# EasyEDA Pro project ProProject_Magic_wand_2024-10-27.epro

# Schematic Schematic1
Create Date: 2024-09-07; Page Name: P1; Project Name: Magic_wand; Schematic Name: Schematic1; Update Date: 2024-09-07
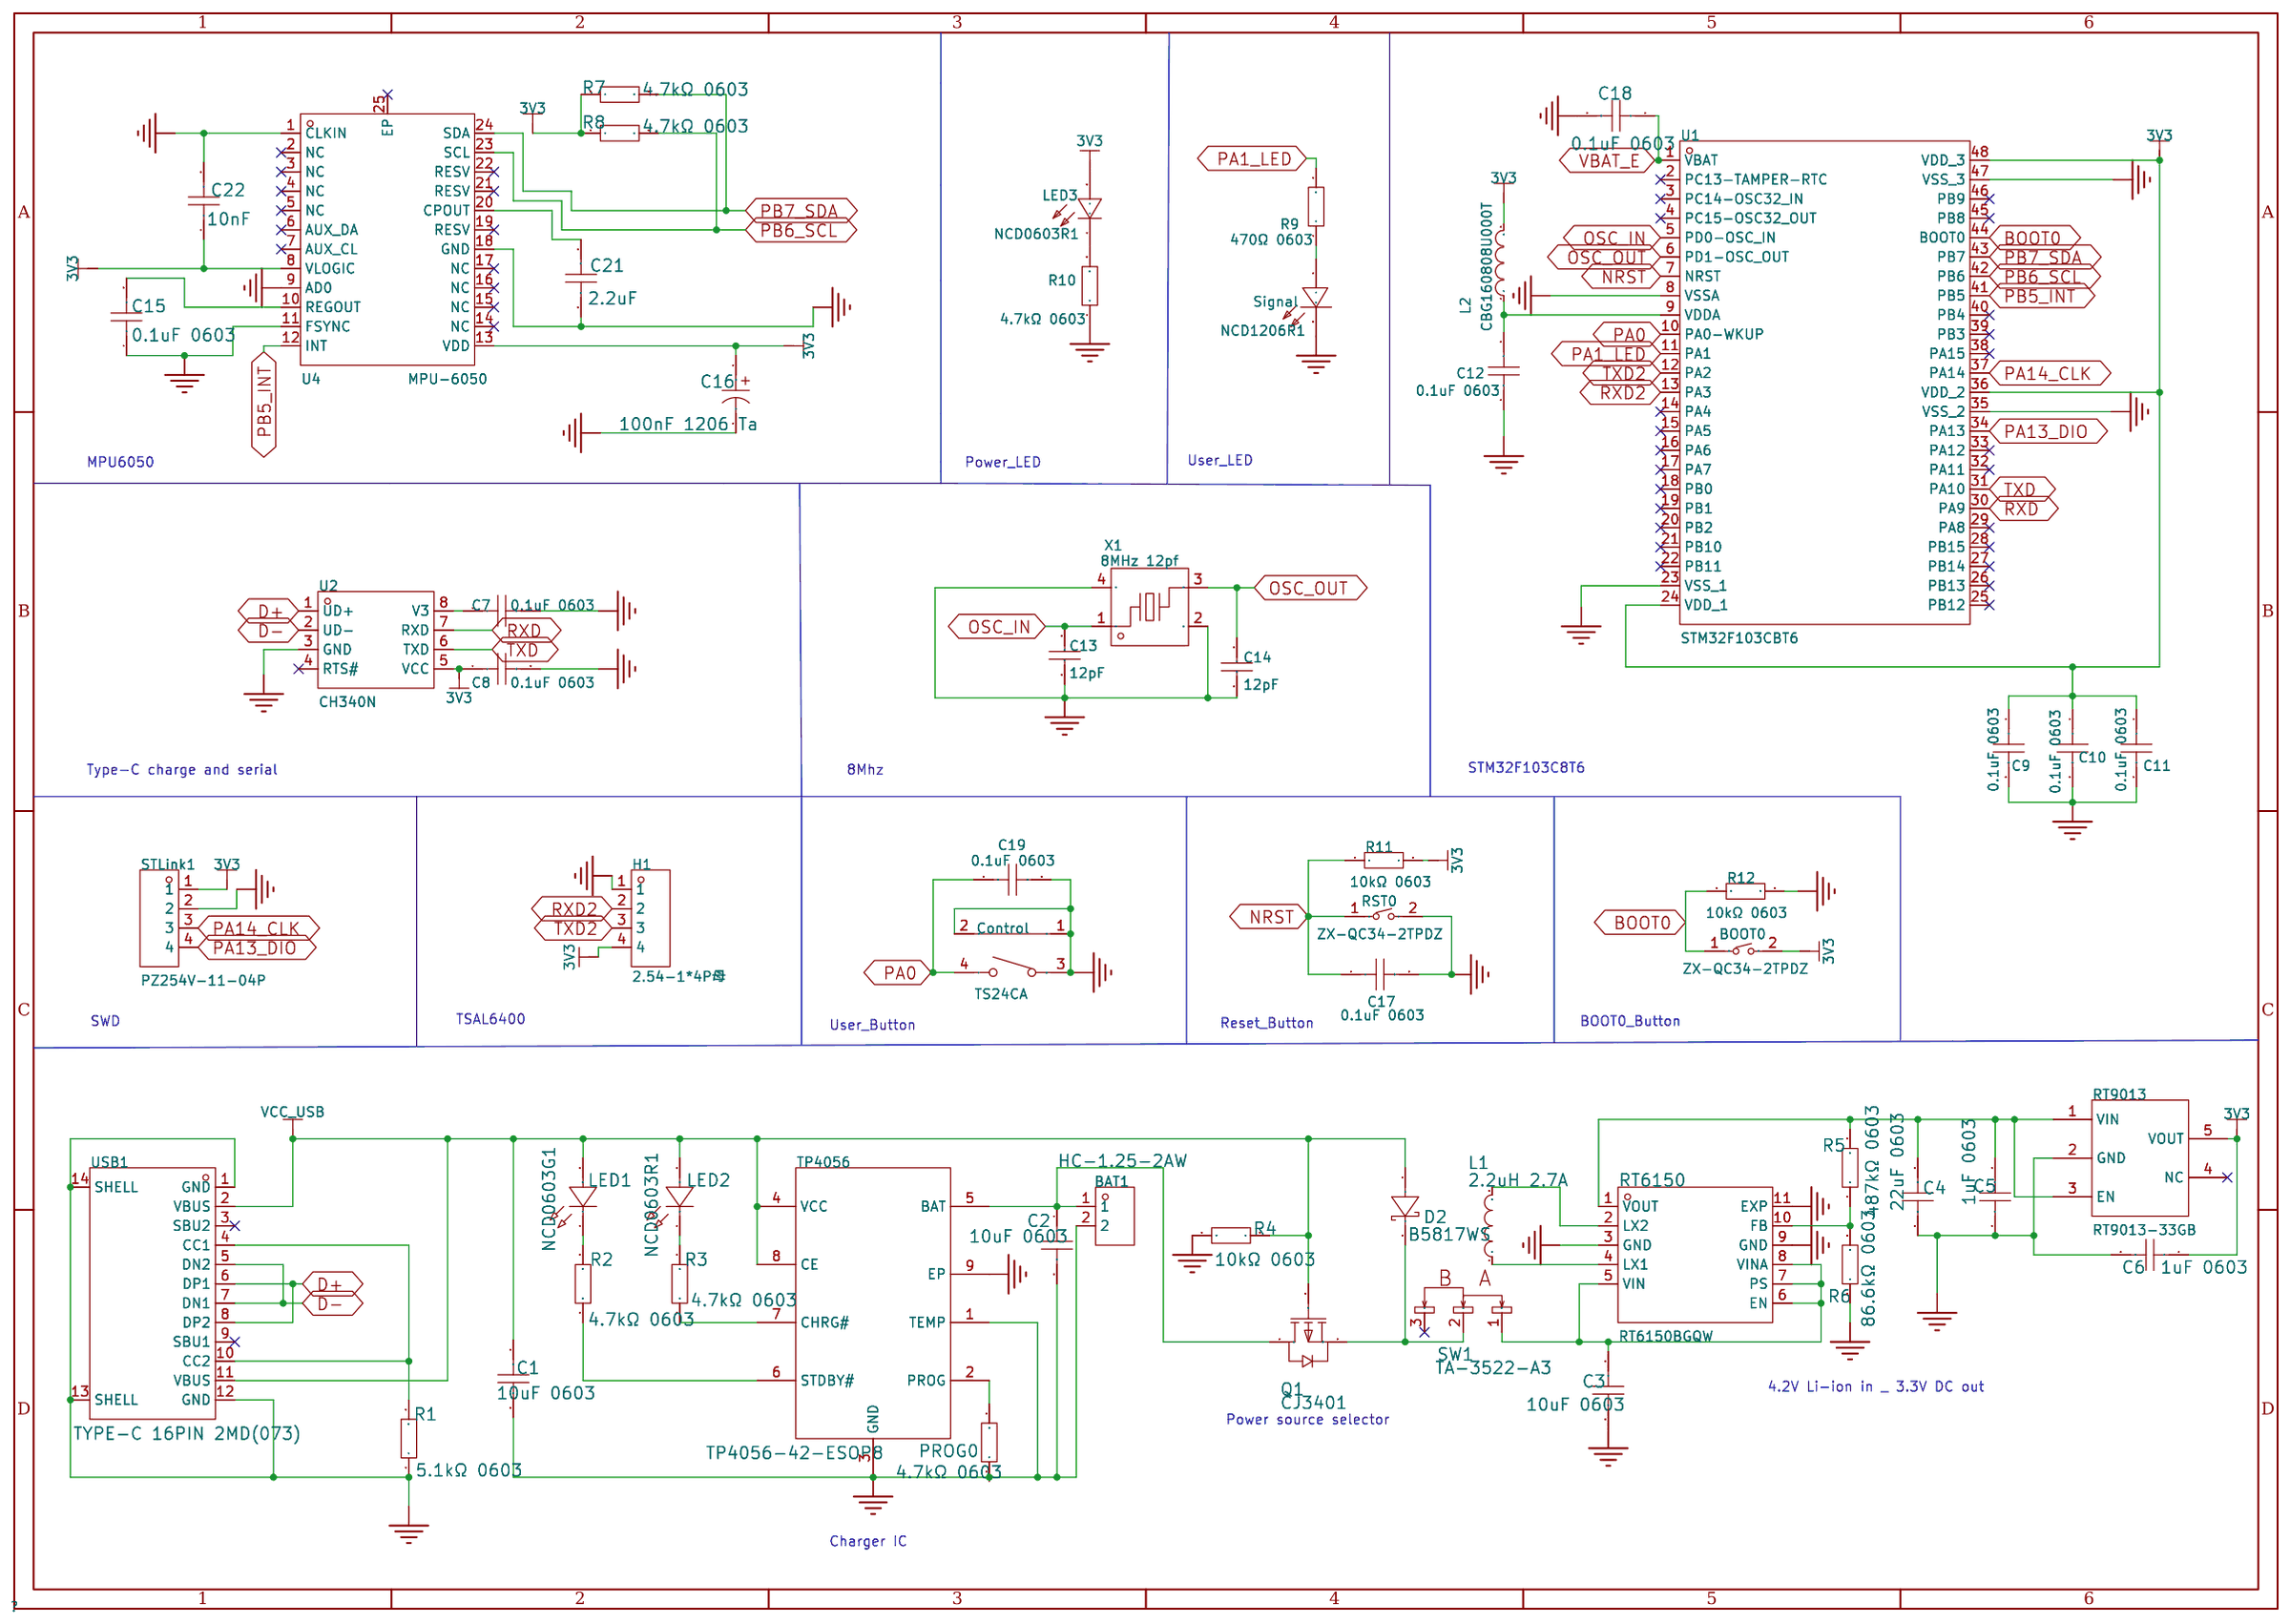
[diagram p0: schematic sheet]

## Parts
BAT1  HC-1.25-2AW  [CONN-TH_2P-P1.25_HCTL_HC-1.25-2AW]
BOOT0  ZX-QC34-2TPDZ  [KEY-SMD_L3.9-W3.0-LS5.0-EH]
C1  10uF 0603  [C0603]
C2  10uF 0603  [C0603]
C3  10uF 0603  [C0603]
C4  22uF 0603  [C0603]
C5  1uF 0603  [C0603]
C6  1uF 0603  [C0603]
C7  0.1uF 0603  [C0603]
C8  0.1uF 0603  [C0603]
C9  0.1uF 0603  [C0603]
C10  0.1uF 0603  [C0603]
C11  0.1uF 0603  [C0603]
C12  0.1uF 0603  [C0603]
C13  12pF  [C0603]
C14  12pF  [C0603]
C15  0.1uF 0603  [C0603]
C16  100nF 1206 Ta  [CAP-SMD_L3.2-W1.6-RD]
C17  0.1uF 0603  [C0603]
C18  0.1uF 0603  [C0603]
C19  0.1uF 0603  [C0603]
C21  2.2uF  [C0603]
C22  10nF  [C0603]
Control  TS24CA  [SW-SMD_TS24CA]
D2  B5817WS  [SOD-323_L1.7-W1.3-LS2.5-FD]
H1  2.54-1*4P母  [HDR-TH_4P-P2.54-V-F]
L1  2.2uH 2.7A  [IND-SMD_L2.5-W2.0]
L2  CBG160808U000T  [L0603]
LED1  NCD0603G1  [LED0603-RD]
LED2  NCD0603R1  [LED0603-RD_RED]
LED3  NCD0603R1  [LED0603-RD_RED]
PROG0  4.7kΩ 0603  [R0603]
Q1  CJ3401  [SOT-23-3_L2.9-W1.6-P1.90-LS2.8-BR]
R1  5.1kΩ 0603  [R0603]
R2  4.7kΩ 0603  [R0603]
R3  4.7kΩ 0603  [R0603]
R4  10kΩ 0603  [R0603]
R5  487kΩ 0603  [R0603]
R6  86.6kΩ 0603  [R0603]
R7  4.7kΩ 0603  [R0603]
R8  4.7kΩ 0603  [R0603]
R9  470Ω 0603  [R0603]
R10  4.7kΩ 0603  [R0603]
R11  10kΩ 0603  [R0603]
R12  10kΩ 0603  [R0603]
RST0  ZX-QC34-2TPDZ  [KEY-SMD_L3.9-W3.0-LS5.0-EH]
RT6150  RT6150BGQW  [WSON-10_L2.5-W2.5-P0.50-BL-EP]
RT9013  RT9013-33GB  [SOT-23-5_L3.0-W1.7-P0.95-LS2.8-BL]
Signal  NCD1206R1  [LED1206-R-RD_RED]
STLink1  PZ254V-11-04P  [HDR-TH_4P-P2.54-V-M]
SW1  TA-3522-A3  [SW-TH_3P-L9.1-W3.5-P2.50-A3]
TP4056  TP4056-42-ESOP8  [ESOP-8_L4.9-W3.9-P1.27-LS6.0-BL-EP]
U1  STM32F103CBT6  [LQFP-48_L7.0-W7.0-P0.50-LS9.0-BL]
U2  CH340N  [SOP-8_L4.9-W3.9-P1.27-LS6.0-BL]
U4  MPU-6050  [QFN-24_L4.0-W4.0-P0.50-BL-EP2.7]
USB1  TYPE-C 16PIN 2MD(073)  [USB-C-SMD_TYPE-C-6PIN-2MD-073]
X1  8MHz 12pf  [OSC-SMD_4P-L3.2-W2.5-BL]

## Library data of the parts
BAT1 = HC-1.25-2AW: 插针结构:1x2P;间距:1.25mm;安装方式:弯插;参考系列:-;总PIN数:2P;排数:1;每排PIN数:2;行距:-;额定电流:1A;触头材质:黄铜;触头镀层:锡;工作温度范围:-25℃~+85℃;; LCSC Part Name: 1x2P 间距:1.25mm 弯插; Supplier Part: C2845535; Manufacturer: HCTL(华灿天禄); Supplier Footprint: 弯插,P=1.25mm; JLCPCB Part Class: 扩展库; Datasheet: https://atta.szlcsc.com/upload/public/pdf/source/20230707/04F6BEA69F699E7BB6558EF06AF1DC24.pdf; Supplier: LCSC; Pins Structure: 1x2P; Pitch: 1.25mm; Mounting Style: 弯插; Number of Pins: 2P; Number of Rows: 1; Number of PINs Per Row: 2; Current Rating (Max): 1A; Contact Material: 黄铜; Contact Plating: 锡; Operating Temperature Range: -25℃~+85℃
BOOT0 RST0 = ZX-QC34-2TPDZ: 电路结构:单刀单掷;按钮形状:圆形按钮;作用力:2.6N;安装方式:立贴;开关长度:3mm;开关宽度:4mm;开关高度:2mm;带支架:不带;触点电流:50mA;额定电压(AC):250V;额定电压(DC):12V;绝缘电阻:100MΩ;机械寿命:10万次;; LCSC Part Name: 3*4*2贴片开关带柱; Supplier Part: C7470219; Manufacturer: Megastar(兆星); Supplier Footprint: SMD; JLCPCB Part Class: 扩展库; Datasheet: https://atta.szlcsc.com/upload/public/pdf/source/20230724/D2731FAADF93973E25928DE23F241F8A.pdf; Supplier: LCSC; Circuit: 单刀单掷; Actuator Style: 圆形按钮; Operating Force: 2.6N; Mounting Style: 立贴; Switch Length: 3mm; Switch Width: 4mm; Switch Height: 2mm; Strike Gundam: 不带; Contact Current: 50mA; Voltage Rating (AC): 250V; Voltage Rating (DC): 12V; Insulation Resistance: 100MΩ; Actuator/Cap Color: 黑色; Pin Style: 鸥翼型; Mechanical Life: 10万次; Operating Temperature: -30℃~+80℃
C1-C12 C15 C17-C19 = CC0603JRNPO9BN101: 容值:100pF;精度:±5%;额定电压:50V;材质(温度系数):NP0;; LCSC Part Name: 100pF ±5% 50V; Supplier Part: C14665; Manufacturer: YAGEO(国巨); Supplier Footprint: 0603; JLCPCB Part Class: 扩展库; Datasheet: https://atta.szlcsc.com/upload/public/pdf/source/20181008/C309499_21CC21451B82C39E3D92150FD6B30293.pdf; Supplier: LCSC; Tolerance: ±5%; Voltage Rated: 50V; Temperature Coefficient: NP0
C13 C14 = CC0603JRNPO9BN200: 容值:20pF;精度:±5%;额定电压:50V;材质(温度系数):NP0;; LCSC Part Name: 20pF ±5% 50V; Supplier Part: C105621; Manufacturer: YAGEO(国巨); Supplier Footprint: 0603; JLCPCB Part Class: 扩展库; Datasheet: https://atta.szlcsc.com/upload/public/pdf/source/20170505/1493957838062.pdf; Supplier: LCSC; Tolerance: ±5%; Voltage Rated: 50V; Temperature Coefficient: NP0
C16 = CA45-A-35V-0.1UF-K: 容值:100nF;精度:±10%;额定电压:35V;; LCSC Part Name: 100nF ±10% 35V; Supplier Part: C2976900; Manufacturer: CEC(振华新云); Supplier Footprint: SMD,1.6x3.2mm; JLCPCB Part Class: 扩展库; Datasheet: https://atta.szlcsc.com/upload/public/pdf/source/20220222/C2C5F368BEBB90E653B4407F98E5644A.pdf; Supplier: LCSC; Tolerance: ±10%; Rated Voltage: 35V; Operating Temperature: -55℃~+125℃
C21 = CL10A225KO8NNNC: 容值:2.2uF;精度:±10%;额定电压:16V;材质(温度系数):X5R;; LCSC Part Name: 2.2uF ±10% 16V; Supplier Part: C23630; Manufacturer: SAMSUNG(三星); Supplier Footprint: 0603; JLCPCB Part Class: Basic Part; Datasheet: https://atta.szlcsc.com/upload/public/pdf/source/20160218/1457707763339.pdf; Supplier: LCSC; Tolerance: ±10%; Voltage Rated: 16V; Temperature Coefficient: X5R
C22 = CC0603KRX7R9BB103: 容值:10nF;精度:±10%;额定电压:50V;材质(温度系数):X7R;; LCSC Part Name: 10nF ±10% 50V; Supplier Part: C100042; Manufacturer: YAGEO(国巨); Supplier Footprint: 0603; JLCPCB Part Class: Extended Part; Datasheet: https://atta.szlcsc.com/upload/public/pdf/source/20181008/C309510_22F155564471FAF6A489F7D68F34234E.pdf; Supplier: LCSC; Tolerance: ±10%; Voltage Rated: 50V; Temperature Coefficient: X7R
Control = TS24CA: 电路结构:单刀单掷;按钮形状:矩形按钮;安装方式:卧贴;开关长度:4.55mm;开关宽度:1.8mm;开关高度:3.5mm;触点电流:50mA;额定电压(DC):12V;带灯:-;机械寿命:-;; LCSC Part Name: 4.55*1.8*3.5mm 卧贴 轻触开关; Supplier Part: C393942; Manufacturer: SHOU HAN(首韩); Supplier Footprint: SMD; JLCPCB Part Class: 扩展库; Datasheet: https://atta.szlcsc.com/upload/public/pdf/source/20190521/C393942_591A9E318887EFA4274D34029981AD99.pdf; Supplier: LCSC; Circuit: 单刀单掷; Actuator Style: 矩形按钮; Mounting Style: 卧贴; Switch Length: 4.55mm; Switch Width: 1.8mm; Switch Height: 3.5mm; Contact Current: 50mA; Voltage Rating (DC): 12V
D2 = B5817WS_C7420329: 二极管配置:独立式;正向压降(Vf):450mV@1.0A;直流反向耐压(Vr):20V;平均整流电流(Io):1A;; LCSC Part Name: 电压:20V 电流:1A; Supplier Part: C7420329; Manufacturer: 宏迦橙; Supplier Footprint: SOD-323; JLCPCB Part Class: 扩展库; Datasheet: https://atta.szlcsc.com/upload/public/pdf/source/20230828/03CA0F4F90DAE368A7153B7B5E4D0651.pdf; Supplier: LCSC; Diode Configuration: 独立式; Forward Voltage (Vf@If): 450mV@1.0A; Reverse Voltage (Vr): 20V; Average Rectified Current (Io): 1A; Reverse Leakage Current (Ir): 1mA@20V
H1 = 2.54-1*4P母: 插孔结构:1x4P;间距:2.54mm;行距:-;圆孔/方孔:方孔;安装类型:直插;排数:单排;总孔位数:4P;额定电流:3A;额定电压:-;插孔方向:顶部;塑高:-;触头材质:青铜;触头镀层:-;工作温度范围:-40℃~+105℃;焊接温度(最大值):-;; LCSC Part Name: 间距:2.54mm 1x4P 直插; Supplier Part: C2718488; Manufacturer: BOOMELE(博穆精密); Supplier Footprint: 插件,P=2.54mm; JLCPCB Part Class: 扩展库; Datasheet: https://atta.szlcsc.com/upload/public/pdf/source/20210301/C2718488_F4427B881E42CAA8DDB0B1C12B3A522C.pdf; Supplier: LCSC; Holes Structure: 1x4P; Pitch: 2.54mm; Circular Hole / Square Hole: 方孔; Mounting Type: 直插; Number of Rows: 单排; Number of Holes: 4P; Current Rating (Max): 3A; Holes Direction: 顶部; Contact Material: 青铜; Operating Temperature Range: -40℃~+105℃
L1 = SRN2512-2R2M: 电感值:2.2uH;精度:±20%;额定电流:2.3A;饱和电流(Isat):2.7A;类型:-;; LCSC Part Name: 2.2uH ±20% 2.7A; Supplier Part: C2041574; Manufacturer: BOURNS; Supplier Footprint: 1008; JLCPCB Part Class: 扩展库; Datasheet: https://atta.szlcsc.com/upload/public/pdf/source/20210630/9277016DFE24E5B118E2E0BE21877B47.pdf; Supplier: LCSC; Tolerance: ±20%; Rated Current: 2.3A; Saturation Current (Isat): 2.7A; DC Resistance (DCR): 102mΩ
L2 = CBG160808U000T: 标称阻抗@测试频率:0Ω@100MHz;直流电阻(RDC):100mΩ;; LCSC Part Name: 单路 0603磁珠 阻抗0Ω@100MHz; Supplier Part: C43163; Manufacturer: FH(风华); Supplier Footprint: 0603; JLCPCB Part Class: 扩展库; Datasheet: https://atta.szlcsc.com/upload/public/pdf/source/20190129/C361667_1614D407CC98D1D3CFBD9E1F7511C14D.pdf; Supplier: LCSC; Impedance @ Frequency: 0Ω@100MHz; DC Resistance: 100mΩ; Current Rating: 800mA; Circuits: 1
LED1 = NCD0603G1: 发光颜色:翠绿色;正向电压(VF):2.6V~3.6V;功率:72mW;正向电流:10mA;主波长:515nm~530nm;透镜颜色:无色透明透镜;发光强度:330mcd~900mcd;发光角度:130°;工作温度:-30℃~+85℃;; Supplier Part: C84267; Manufacturer: 国星光电; Supplier Footprint: 0603; JLCPCB Part Class: Extended Part; Datasheet: https://atta.szlcsc.com/upload/public/pdf/source/20200820/C84267_04BA7703640BAC111D09F5EFB971FBF3.pdf; Supplier: LCSC; Emitted Color: 翠绿色; Forward Voltage (VF): 2.6V~3.6V; Power Dissipation: 72mW; Forward Current: 10mA; Dominant Wavelength: 515nm~530nm; Lens Color: 无色透明透镜; Luminous Intensity: 330mcd~900mcd; Viewing Angle: 130°; Operating Temperature: -30℃~+85℃; Peak Wavelength: 525nm
LED2 = NCD0603R1_C84263: 灯头类型:-;发光颜色:红色;正向电压(VF):1.6V~2.6V;功率:65mW;正向电流:20mA;主波长:615nm~630nm;二极管配置:独立二极管;透镜颜色:无色透明透镜;色温:-;发光强度:80mcd~220mcd;发光角度:130°;载带方式:-;工作温度:-30℃~+85℃;; Supplier Part: C84263; Manufacturer: 国星光电; Supplier Footprint: 0603; JLCPCB Part Class: Extended Part; Datasheet: https://atta.szlcsc.com/upload/public/pdf/source/20200820/C84263_DABC6A75E58F576973B407FDBA283D60.pdf; Supplier: LCSC; Emitted Color: 红色; Forward Voltage (VF): 1.6V~2.6V; Power Dissipation: 65mW; Forward Current: 20mA; Dominant Wavelength: 615nm~630nm; Diode Configuration: 独立二极管; Lens Color: 无色透明透镜; Luminous Intensity: 80mcd~220mcd; Viewing Angle: 130°; Operating Temperature: -30℃~+85℃
LED3 = NCD0603R1_C84263: 灯头类型:-;发光颜色:红色;正向电压(VF):1.6V~2.6V;功率:65mW;正向电流:20mA;主波长:615nm~630nm;二极管配置:独立二极管;透镜颜色:无色透明透镜;色温:-;发光强度:80mcd~220mcd;发光角度:130°;载带方式:-;工作温度:-30℃~+85℃;; Supplier Part: C84263; Manufacturer: 国星光电; Supplier Footprint: 0603; JLCPCB Part Class: 扩展库; Datasheet: https://atta.szlcsc.com/upload/public/pdf/source/20200820/C84263_DABC6A75E58F576973B407FDBA283D60.pdf; Supplier: LCSC; Emitted Color: 红色; Forward Voltage (VF): 1.6V~2.6V; Power Dissipation: 65mW; Forward Current: 20mA; Dominant Wavelength: 615nm~630nm; Diode Configuration: 独立二极管; Lens Color: 无色透明透镜; Luminous Intensity: 80mcd~220mcd; Viewing Angle: 130°; Operating Temperature: -30℃~+85℃
PROG0 R1-R12 = 0603WAF1002T5E: 电阻类型:厚膜电阻;阻值:10kΩ;精度:±1%;功率:100mW;最大工作电压:75V;温度系数:±100ppm/℃;; LCSC Part Name: 厚膜电阻 10kΩ ±1% 100mW; Supplier Part: C25804; Manufacturer: UNI-ROYAL(厚声); Supplier Footprint: 0603; JLCPCB Part Class: 基础库; Datasheet: https://atta.szlcsc.com/upload/public/pdf/source/20200306/C422600_1E6D84923E4A46A82E41ADD87F860B5C.pdf; Supplier: LCSC; Type: 厚膜电阻; Tolerance: ±1%; Power(Watts): 100mW; Overload Voltage (Max): 75V; Temperature Coefficient: ±100ppm/℃; Operating Temperature Range: -55℃~+155℃
Q1 = CJ3401: 类型:1个P沟道;漏源电压(Vdss):30V;连续漏极电流(Id):4.2A;功率(Pd):350mW;导通电阻(RDS(on)@Vgs,Id):65mΩ@10V,4.2A;阈值电压(Vgs(th)@Id):1.3V@250uA;; LCSC Part Name: 1个P沟道 耐压:30V 电流:4.2A; Supplier Part: C13799; Manufacturer: CJ(江苏长电/长晶); Supplier Footprint: SOT-23; JLCPCB Part Class: 扩展库; Datasheet: https://atta.szlcsc.com/upload/public/pdf/source/20140815/1457707217656.pdf; Supplier: LCSC; Type: 1个P沟道; Drain Source Voltage (Vdss): 30V; Continuous Drain Current (Id): 4.2A; Power Dissipation (Pd): 350mW; Drain Source On Resistance (RDS(on)@Vgs,Id): 65mΩ@10V,4.2A; Gate Threshold Voltage (Vgs(th)@Id): 1.3V@250uA
RT6150 = RT6150BGQW: 功能类型:升降压型;输入电压:1.8V~5.5V;输出电压:1.8V~5.5V;输出电流(最大值):800mA;; Supplier Part: C147972; Manufacturer: RICHTEK(立锜); Supplier Footprint: WSON-10-EP(2.5x2.5); JLCPCB Part Class: 扩展库; Datasheet: https://atta.szlcsc.com/upload/public/pdf/source/20180126/C147972_15169561259341309260.pdf; Supplier: LCSC; Function: 升降压型; Input Voltage: 1.8V~5.5V; Output Voltage: 1.8V~5.5V; Output Current (Max): 800mA; Switching Frequency: 1MHz; Synchronous Rectification: 是; Number of Outputs: 1; Topology: 降压-升压式; Switch tube (built-in/external): 内置
RT9013 = RT9013-33GB: 输出类型:固定;最大输入电压:5.5V;输出电压:3.3V;最大输出电流:500mA;电源纹波抑制比(PSRR):50dB@(10kHz);输出极性:正极;; LCSC Part Name: 输入5.5V 输出3.3V 500mA; Supplier Part: C47773; Manufacturer: RICHTEK(立锜); Supplier Footprint: SOT-23-5; JLCPCB Part Class: 扩展库; Datasheet: https://atta.szlcsc.com/upload/public/pdf/source/20150504/1457707282459.pdf; Supplier: LCSC; Output Type: 固定; Maximum Input Voltage: 5.5V; Output Voltage: 3.3V; MAX Output Current: 500mA; Power Supply Rejection Ratio (PSRR): 50dB@(10kHz); Dropout Voltage: 400mV@(500mA); standby current: 50uA; Operating Temperature: -40℃~+85℃; Output Polarity: 正极; Number of Outputs: 1
Signal = NCD1206R1: 发光颜色:红色;正向电压(VF):1.6V~2.6V;功率:65mW;正向电流:20mA;主波长:615nm~630nm;透镜颜色:无色透明透镜;发光强度:67mcd~195mcd;发光角度:130°;工作温度:-30℃~+85℃;; Supplier Part: C84270; Manufacturer: 国星光电; Supplier Footprint: 1206; JLCPCB Part Class: 扩展库; Datasheet: https://atta.szlcsc.com/upload/public/pdf/source/20200820/C84270_26D056BA53480CD9796A84C2EB45318C.pdf; Supplier: LCSC; Emitted Color: 红色; Forward Voltage (VF): 1.6V~2.6V; Power Dissipation: 65mW; Forward Current: 20mA; Dominant Wavelength: 615nm~630nm; Lens Color: 无色透明透镜; Luminous Intensity: 67mcd~195mcd; Viewing Angle: 130°; Operating Temperature: -30℃~+85℃
STLink1 = PZ254V-11-04P: 插针结构:1x4P;间距:2.54mm;行距:-;圆针/方针:方针;安装类型:直插;排数:单排;总PIN位数:4P;额定电流:3A;额定电压:250V;配合针长度:6mm;塑高:2.5mm;端接针长度:3mm;触头材质:-;工作温度范围:-40℃~+105℃;颜色:黑色;; LCSC Part Name: 间距:2.54mm 1x4P 直插 方针; Supplier Part: C2691448; Manufacturer: XFCN(兴飞); Supplier Footprint: 插件,P=2.54mm; JLCPCB Part Class: 扩展库; Datasheet: https://atta.szlcsc.com/upload/public/pdf/source/20200309/C492403_F9F19131791D08044AD4F84F8E751A34.pdf; Supplier: LCSC; Pin Structure: 1x4P; Pitch: 2.54mm; Circluar Pins/Square Pins: 方针; Mounting Type: 直插; Number of Rows: 单排; Number of Pins: 4P; Current Rating (Max): 3A; Voltage Rating (Max): 250V; Length of Mating Pin: 6mm; Insulation Height: 2.5mm; Length of End Connection Pin: 3mm; Operating Temperature Range: -40℃~+105℃; Color: 黑色
SW1 = TA-3522-A3: LCSC Part Name: 滑动开关9.1*3.5*4.0mm插件侧拨三脚二档; Supplier Part: C514011; Manufacturer: Yuandi(元迪); Supplier Footprint: 插件-3P,3.5x9.1mm,弯插; JLCPCB Part Class: 扩展库; Datasheet: https://atta.szlcsc.com/upload/public/pdf/source/20200415/C514009_6EED03F5D6F9885D6506BA57997A5078.pdf; Supplier: LCSC
TP4056 = TP4056-42-ESOP8: 锂电池充电芯片 42代表电池满电电压4.2V。; Supplier Part: C16581; Manufacturer: TOPPOWER(南京拓微); Supplier Footprint: ESOP-8; JLCPCB Part Class: 扩展库; Datasheet: https://atta.szlcsc.com/upload/public/pdf/source/20190626/C16581_611BCF5D7CF554EAE465137A8F68DB3E.pdf; Supplier: LCSC
U1 = STM32F103CBT6: CPU内核:ARM-M3;程序存储容量:128KB;RAM总容量:20KB;GPIO端口数量:37;工作电压范围:2V~3.6V;CPU最大主频:72MHz;程序存储器类型:FLASH;; LCSC Part Name: 主流增强型ARM Cortex-M3 MCU，具有128 KB Flash、72 MHz CPU、电机控制、USB和CAN; Supplier Part: C8304; Manufacturer: ST(意法半导体); Supplier Footprint: LQFP-48(7x7); JLCPCB Part Class: Extended Part; Datasheet: https://atta.szlcsc.com/upload/public/pdf/source/20150811/1457707344439.pdf; Supplier: LCSC; CPU Core: ARM-M3; Program Storage Size: 128KB; RAM Size: 20KB; GPIO Ports Number: 37; Operating Voltage Range: 2V~3.6V; CPU Maximum Speed: 72MHz; Program Memory Type: FLASH; Operating Temperature Range: -40℃~+85℃; ADC (Bit): 12bit; Universal Serial Bus: 有; Peripheral/Function: DMA；温度传感器；PWM; Watchdog: 有; Infrared Data Association: 有; Low-Voltage Detect: 有; Direct Memory Access: 有; Internal Oscillator: 有; 16Bit Timer: 3; CAN: 1; UART/USART: 3; I2C: 2; SPI: 3
U2 = CH340N: LCSC Part Name: USB转串口芯片 CH340; Supplier Part: C2977777; Manufacturer: WCH(南京沁恒); Supplier Footprint: SOP-8; JLCPCB Part Class: 扩展库; Datasheet: https://atta.szlcsc.com/upload/public/pdf/source/20230530/6E401E9554E9F5311886CC8B3F89B62E.pdf; Supplier: LCSC
U4 = MPU-6050: 传感器类型:加速度计陀螺仪;; Supplier Part: C24112; Manufacturer: TDK InvenSense(应美盛); Supplier Footprint: QFN-24-EP(4x4); JLCPCB Part Class: 扩展库; Datasheet: https://atta.szlcsc.com/upload/public/pdf/source/20140425/1457707046159.pdf; Supplier: LCSC; Sensor Type: 加速度计陀螺仪; Operating Temperature: -40℃~+85℃
USB1 = TYPE-C 16PIN 2MD(073): 连接器类型:Type-C;标准:-;公母:母;端口数量:1;触点数量:16P;安装方式:卧贴;额定电流 - 电源:5A;工作温度范围:-25℃~+85℃;; LCSC Part Name: Type-C 母 卧贴; Supplier Part: C2765186; Manufacturer: SHOU HAN(首韩); Supplier Footprint: SMD; JLCPCB Part Class: Extended Part; Datasheet: https://atta.szlcsc.com/upload/public/pdf/source/20211123/39B17C16241EAC15C5E277BDA434118E.pdf; Supplier: LCSC; Connector Type: Type-C; Gender: 母; Number of Ports: 1; Number of Contacts: 16P; Mounting Style: 卧贴; Current Rating - Power (Max): 5A; Operating Temperature Range: -25℃~+85℃
X1 = X32258MOB4SI: 晶振类型:贴片晶振;频率:8MHz;常温频差:±10ppm;外接负载电容:12pF;频率稳定度(全温):±20ppm;; LCSC Part Name: 8MHz ±10ppm 12pF; Supplier Part: C2682775; Manufacturer: YXC(扬兴晶振); Supplier Footprint: SMD3225-4P; JLCPCB Part Class: 扩展库; Datasheet: https://atta.szlcsc.com/upload/public/pdf/source/20240329/19D5F850207469550BEB00D7DFEDBC7A.pdf; Supplier: LCSC; Crystal Type: 贴片晶振; Normal temperature Frequency Tolerance: ±10ppm; External load capacitor: 12pF; Frequency Stability(Full temperature range): ±20ppm; Equivalent Series Resistance (ESR): 150Ω; Operating Temperature: -40℃~+85℃

## Nets
3V3: BOOT0.2 C6.1 C8.1 C9.1 C10.1 C11.1 C16.1 C22.1 H1.4 L2.2 LED3.2(A) R7.1 R8.1 R11.2 RT9013.5(VOUT) STLink1.1 U1.24(VDD_1) U1.36(VDD_2) U1.48(VDD_3) U2.5(VCC) U4.8(VLOGIC) U4.13(VDD)
GND: BAT1.2 C1.2 C2.2 C3.2 C4.2 C5.2 C6.2 C7.2 C8.2 C9.2 C10.2 C11.2 C12.1 C13.1 C14.1 C15.1 C16.2 C17.2 C18.2 C19.2 C21.2 C22.2 Control.1 Control.2 Control.3 H1.1 PROG0.1 R1.1 R4.2 R6.1 R10.1 R12.2 RST0.2 RT6150.3(GND) RT6150.9(GND) RT6150.11(EXP) RT9013.2(GND) Signal.2(K) STLink1.2 TP4056.1(TEMP) TP4056.3(GND) TP4056.9(EP) U1.8(VSSA) U1.23(VSS_1) U1.35(VSS_2) U1.47(VSS_3) U2.3(GND) U4.1(CLKIN) U4.9(AD0) U4.11(FSYNC) U4.18(GND) USB1.1(GND) USB1.12(GND) USB1.13(SHELL) USB1.14(SHELL) X1.2(GND) X1.4(GND)
VBAT_E: C18.1 U1.1(VBAT)
VCC_USB: C1.1 D2.1(A) LED1.2(A) LED2.2(A) Q1.1(G) R4.1 TP4056.4(VCC) TP4056.8(CE) USB1.2(VBUS) USB1.11(VBUS)
BOOT0: BOOT0.1 R12.1 U1.44(BOOT0)
D+: U2.1(UD+) USB1.6(DP1) USB1.8(DP2)
D-: U2.2(UD-) USB1.5(DN2) USB1.7(DN1)
NRST: C17.1 R11.1 RST0.1 U1.7(NRST)
OSC_IN: C13.2 U1.5(PD0-OSC_IN) X1.1
OSC_OUT: C14.2 U1.6(PD1-OSC_OUT) X1.3
PA0: C19.1 Control.4 U1.10(PA0-WKUP)
PA1_LED: R9.2 U1.11(PA1)
PA13_DIO: STLink1.4 U1.34(PA13)
PA14_CLK: STLink1.3 U1.37(PA14)
PB5_INT: U1.41(PB5) U4.12(INT)
PB6_SCL: R8.2 U1.42(PB6) U4.23(SCL)
PB7_SDA: R7.2 U1.43(PB7) U4.24(SDA)
RXD: U1.30(PA9) U2.7(RXD)
RXD2: H1.2 U1.13(PA3)
TXD: U1.31(PA10) U2.6(TXD)
TXD2: H1.3 U1.12(PA2)
$1N2583: C12.2 L2.1 U1.9(VDDA)
$1N4826: R9.1 Signal.1(A)
$1N5009: LED3.1(K) R10.2
$1N5948: C7.1 U2.8(V3)
$1N6568: C15.2 U4.10(REGOUT)
$1N6572: C21.1 U4.20(CPOUT)
$1N8092: L1.2 RT6150.2(LX2)
$1N8095: R5.1 R6.2 RT6150.10(FB)
$1N8102: R1.2 USB1.4(CC1) USB1.10(CC2)
$1N8103: LED2.1(K) R3.2
$1N8104: LED1.1(K) R2.2
$1N8106: R3.1 TP4056.7(CHRG#)
$1N8107: R2.1 TP4056.6(STDBY#)
$1N8108: PROG0.2 TP4056.2(PROG)
$1N8109: BAT1.1 C2.1 Q1.3(D) TP4056.5(BAT)
$1N8111: L1.1 RT6150.4(LX1)
$1N8114: D2.2(K) Q1.2(S) SW1.2
$1N8115: C3.1 RT6150.5(VIN) RT6150.6(EN) RT6150.7(PS) RT6150.8(VINA) SW1.1
$1N8116: C4.1 C5.1 R5.2 RT6150.1(VOUT) RT9013.1(VIN) RT9013.3(EN)

Not connected (* = marked no-connect by the designer): RT9013 4(NC)*; SW1 3*; U1 2(PC13-TAMPER-RTC)* 3(PC14-OSC32_IN)* 4(PC15-OSC32_OUT)* 14(PA4)* 15(PA5)* 16(PA6)* 17(PA7)* 18(PB0)* 19(PB1)* 20(PB2)* 21(PB10)* 22(PB11)* 25(PB12)* 26(PB13)* 27(PB14)* 28(PB15)* 29(PA8)* 32(PA11)* 33(PA12)* 38(PA15)* 39(PB3)* 40(PB4)* 45(PB8)* 46(PB9)*; U2 4(RTS#)*; U4 2(NC)* 3(NC)* 4(NC)* 5(NC)* 6(AUX_DA)* 7(AUX_CL)* 14(NC)* 15(NC)* 16(NC)* 17(NC)* 19(RESV)* 21(RESV)* 22(RESV)* 25(EP)*; USB1 3(SBU2)* 9(SBU1)*

## Notes on the sheet
- MPU6050
- Power_LED
- User_LED
- Type-C charge and serial
- 8Mhz
- STM32F103C8T6
- SWD
- TSAL6400
- BOOT0_Button
- User_Button
- Reset_Button
- 4.2V Li-ion in _ 3.3V DC out
- Power source selector
- Charger IC

# Board PCB1
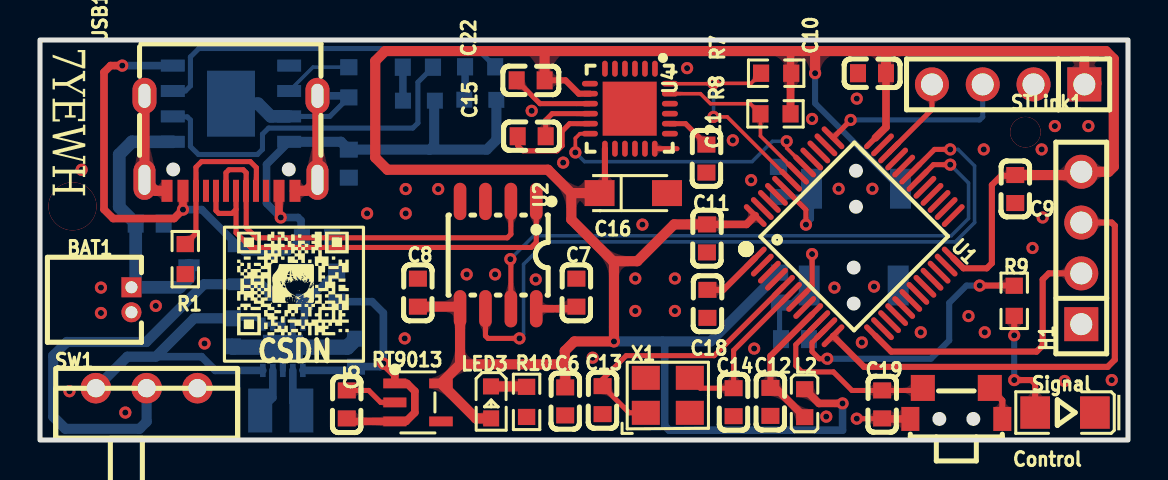
[diagram p1: board, top side]
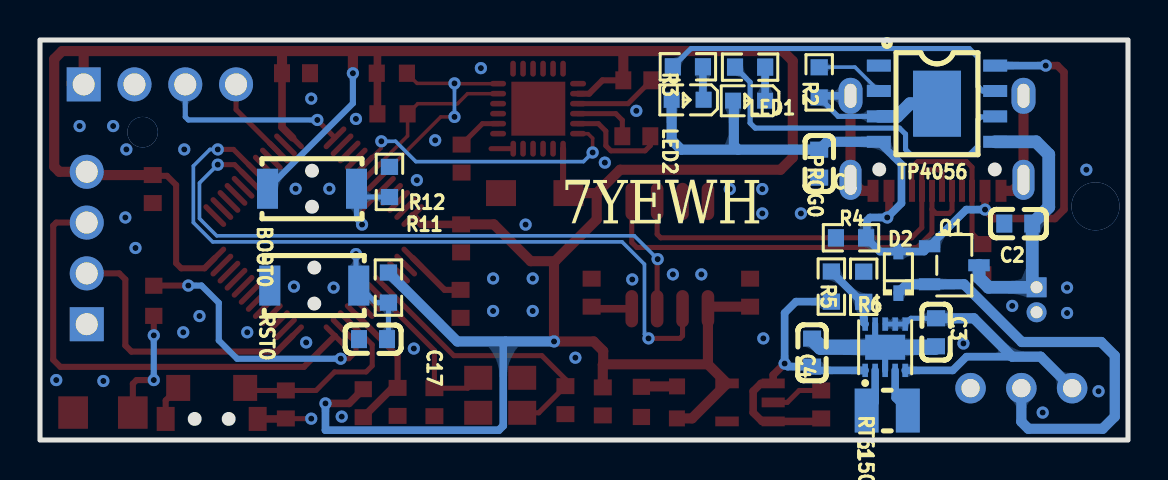
[diagram p2: board, bottom side, seen from below]

Outline 54.41 x 20 mm; copper layers: Top Layer, Bottom Layer. Coordinates in mm from the lower left corner of the outline.
Outline path: rectangle 0,20 54.41,0
Stack: Top Layer 0.035mm / Dielectric1 1.51mm FR4 er 4.5 / Bottom Layer 0.035mm

## Design rules (mm)
template: 自定义配置
spacing copperThickness1oz (default): track to track 0.102, other pairs 0.152 to 0.3
spacing copperThickness2oz: track to track 0.203, other pairs 0.152 to 0.3
track width copperThickness1oz (default): min 0.127, default 0.254, max 2.54
track width copperThickness2oz: min 0.203, default 0.254, max 2.54
differential pair differentialPair (default): width min 0.127, default 0.254, max 2.54; gap min 0.152, default 0.152
via viaSize (default): diameter min 0.5, default 0.61, max 10; hole min 0.3, default 0.305, max 6.299

## Placement (name value [footprint] x y rotation side)
BAT1  HC-1.25-2AW  [CONN-TH_2P-P1.25_HCTL_HC-1.25-2AW]  4.57 7.01 270 top
BOOT0  ZX-QC34-2TPDZ  [KEY-SMD_L3.9-W3.0-LS5.0-EH]  40.81 12.56 0 bottom
C1  10uF 0603  [C0603]  15.44 13.82 270 bottom
C2  10uF 0603  [C0603]  5.49 10.82 0 bottom
C3  10uF 0603  [C0603]  9.6 5.39 270 bottom
C4  22uF 0603  [C0603]  15.8 4.37 90 bottom
C5  1uF 0603  [C0603]  15.34 1.78 90 top
C6  1uF 0603  [C0603]  26.26 1.93 270 top
C7  0.1uF 0603  [C0603]  26.82 7.37 90 top
C8  0.1uF 0603  [C0603]  18.9 7.37 90 top
C9  0.1uF 0603  [C0603]  48.77 12.55 270 top
C10  0.1uF 0603  [C0603]  41.6 18.34 180 top
C11  0.1uF 0603  [C0603]  33.35 10.08 270 top
C12  0.1uF 0603  [C0603]  36.53 1.91 90 top
C13  12pF  [C0603]  28.13 1.99 90 top
C14  12pF  [C0603]  34.69 1.89 90 top
C15  0.1uF 0603  [C0603]  24.59 15.19 0 top
C16  100nF 1206 Ta  [CAP-SMD_L3.2-W1.6-RD]  29.67 12.34 0 top
C17  0.1uF 0603  [C0603]  37.75 5.04 0 bottom
C18  0.1uF 0603  [C0603]  33.38 6.81 270 top
C19  0.1uF 0603  [C0603]  42.11 1.78 270 top
C21  2.2uF  [C0603]  33.32 14.07 270 top
C22  10nF  [C0603]  24.54 17.98 180 top
Control  TS24CA  [SW-SMD_TS24CA]  45.82 1.83 180 top
D2  B5817WS  [SOD-323_L1.7-W1.3-LS2.5-FD]  11.48 8.38 270 bottom
H1  2.54-1*4P母  [HDR-TH_4P-P2.54-V-F]  52.07 9.6 90 top
L1  2.2uH 2.7A  [IND-SMD_L2.5-W2.0]  12.04 1.47 180 bottom
L2  CBG160808U000T  [L0603]  38.24 1.84 90 top
LED1  NCD0603G1  [LED0603-RD]  18.95 16.97 0 bottom
LED2  NCD0603R1  [LED0603-RD_RED]  22.02 17.01 0 bottom
LED3  NCD0603R1  [LED0603-RD_RED]  22.56 1.88 270 top
PROG0  4.7kΩ 0603  [R0603]  15.44 17.88 90 bottom
Q1  CJ3401  [SOT-23-3_L2.9-W1.6-P1.90-LS2.8-BR]  8.69 8.74 0 bottom
R1  5.1kΩ 0603  [R0603]  7.26 9.04 90 top
R2  4.7kΩ 0603  [R0603]  18.9 18.64 180 bottom
R3  4.7kΩ 0603  [R0603]  22.01 18.66 180 bottom
R4  10kΩ 0603  [R0603]  13.85 10.11 0 bottom
R5  487kΩ 0603  [R0603]  14.83 7.67 270 bottom
R6  86.6kΩ 0603  [R0603]  13.22 7.66 270 bottom
R7  4.7kΩ 0603  [R0603]  36.81 18.34 180 top
R8  4.7kΩ 0603  [R0603]  36.78 16.31 180 top
R9  470Ω 0603  [R0603]  48.72 6.96 90 top
R10  4.7kΩ 0603  [R0603]  24.33 1.91 90 top
R11  10kΩ 0603  [R0603]  36.98 7.62 90 bottom
R12  10kΩ 0603  [R0603]  36.93 12.9 90 bottom
RST0  ZX-QC34-2TPDZ  [KEY-SMD_L3.9-W3.0-LS5.0-EH]  40.69 7.72 0 bottom
RT6150  RT6150BGQW  [WSON-10_L2.5-W2.5-P0.50-BL-EP]  12.14 4.64 180 bottom
RT9013  RT9013-33GB  [SOT-23-5_L3.0-W1.7-P0.95-LS2.8-BL]  18.9 1.88 270 top
Signal  NCD1206R1  [LED1206-R-RD_RED]  51.26 1.37 180 top
STLink1  PZ254V-11-04P  [HDR-TH_4P-P2.54-V-M]  48.41 17.78 180 top
SW1  TA-3522-A3  [SW-TH_3P-L9.1-W3.5-P2.50-A3]  5.33 2.59 0 top
TP4056  TP4056-42-ESOP8  [ESOP-8_L4.9-W3.9-P1.27-LS6.0-BL-EP]  9.55 16.81 270 bottom
U1  STM32F103CBT6  [LQFP-48_L7.0-W7.0-P0.50-LS9.0-BL]  40.72 10.16 315 top
U2  CH340N  [SOP-8_L4.9-W3.9-P1.27-LS6.0-BL]  22.91 9.25 180 top
U4  MPU-6050  [QFN-24_L4.0-W4.0-P0.50-BL-EP2.7]  29.5 16.57 180 top
USB1  TYPE-C 16PIN 2MD(073)  [USB-C-SMD_TYPE-C-6PIN-2MD-073]  9.55 14.83 180 top
X1  8MHz 12pf  [OSC-SMD_4P-L3.2-W2.5-BL]  31.39 2.23 0 top

## Footprints (pads in the part's own frame, mm; a bottom-side part is the same pattern mirrored in y, then rotated)
C0603
  rect 0.8x0.9 smd: 1(-0.7,0) 2(0.7,0)
CAP-SMD_L3.2-W1.6-RD
  rect 1.5x1.296 smd: 1(-1.687,0) 2(1.687,0)
CONN-TH_2P-P1.25_HCTL_HC-1.25-2AW
  rect 1x1 hole 0.6: 1(-0.625,0)
  round 1 hole 0.6: 2(0.625,0)
ESOP-8_L4.9-W3.9-P1.27-LS6.0-BL-EP
  rect 0.6x1.2 smd: 1(-1.905,-2.909) 2(-0.635,-2.909) 3(0.635,-2.909) 4(1.905,-2.909) 5(1.905,2.909) 6(0.635,2.909) 7(-0.635,2.909) 8(-1.905,2.909)
  rect 3.3x2.4 smd: 9(0,0)
HDR-TH_4P-P2.54-V-F
  rect 1.7x1.7 hole 1.1: 1(-3.81,0)
  round 1.7 hole 1.1: 2(-1.27,0) 3(1.27,0) 4(3.81,0)
HDR-TH_4P-P2.54-V-M
  rect 1.7x1.7 hole 1.1: 1(-3.81,0)
  round 1.7 hole 1.1: 2(-1.27,0) 3(1.27,0) 4(3.81,0)
IND-SMD_L2.5-W2.0
  rect 1.2x2.2 smd: 1(1.028,0) 2(-1.028,0)
KEY-SMD_L3.9-W3.0-LS5.0-EH
  rect 1.05x2 smd: 1(-2.225,0) 2(2.225,0)
L0603
  rect 0.8x0.864 smd: 1(-0.7,0) 2(0.7,0)
LED0603-RD
  rect 0.8x0.8 smd: 1(-0.799,0) 2(0.799,0)
LED0603-RD_RED
  rect 0.8x0.8 smd: 1(-0.799,-0.004) 2(0.799,0.004)
LED1206-R-RD_RED
  rect 1.485x1.62 smd: 1(1.492,0) 2(-1.492,0)
LQFP-48_L7.0-W7.0-P0.50-LS9.0-BL
  oval 0.27x1.5 smd: 1(-2.75,-4.25) 2(-2.25,-4.25) 3(-1.75,-4.25) 4(-1.25,-4.25) 5(-0.75,-4.25) 6(-0.25,-4.25) 7(0.25,-4.25) 8(0.75,-4.25) 9(1.25,-4.25) 10(1.75,-4.25) 11(2.25,-4.25) 12(2.75,-4.25) 25(2.75,4.25) 26(2.25,4.25) 27(1.75,4.25) 28(1.25,4.25) 29(0.75,4.25) 30(0.25,4.25) 31(-0.25,4.25) 32(-0.75,4.25) 33(-1.25,4.25) 34(-1.75,4.25) 35(-2.25,4.25) 36(-2.75,4.25)
  oval 1.5x0.27 smd: 13(4.25,-2.75) 14(4.25,-2.25) 15(4.25,-1.75) 16(4.25,-1.25) 17(4.25,-0.75) 18(4.25,-0.25) 19(4.25,0.25) 20(4.25,0.75) 21(4.25,1.25) 22(4.25,1.75) 23(4.25,2.25) 24(4.25,2.75) 37(-4.25,2.75) 38(-4.25,2.25) 39(-4.25,1.75) 40(-4.25,1.25) 41(-4.25,0.75) 42(-4.25,0.25) 43(-4.25,-0.25) 44(-4.25,-0.75) 45(-4.25,-1.25) 46(-4.25,-1.75) 47(-4.25,-2.25) 48(-4.25,-2.75)
OSC-SMD_4P-L3.2-W2.5-BL
  rect 1.4x1.2 smd: 1(-1.1,-0.875) 2(1.1,-0.875) 3(1.1,0.875) 4(-1.1,0.875)
QFN-24_L4.0-W4.0-P0.50-BL-EP2.7
  oval 0.28x0.8 smd: 1(-1.25,-2) 2(-0.75,-2) 3(-0.25,-2) 4(0.25,-2) 5(0.75,-2) 6(1.25,-2) 13(1.25,2) 14(0.75,2) 15(0.25,2) 16(-0.25,2) 17(-0.75,2) 18(-1.242,2)
  oval 0.8x0.28 smd: 7(2,-1.25) 8(2,-0.75) 9(2,-0.25) 10(2,0.25) 11(2,0.75) 12(2,1.25) 19(-2,1.25) 20(-2,0.75) 21(-2,0.25) 22(-2,-0.25) 23(-2,-0.75) 24(-2,-1.25)
  rect 2.7x2.7 smd: 25(0.013,0)
R0603
  rect 0.806x0.864 smd: 1(-0.753,0) 2(0.753,0)
SOD-323_L1.7-W1.3-LS2.5-FD
  rect 0.78x0.5 smd: 1(-1.04,0) 2(1.04,0)
SOP-8_L4.9-W3.9-P1.27-LS6.0-BL
  oval 0.63x1.865 smd: 1(-1.905,-2.683) 2(-0.635,-2.683) 3(0.635,-2.683) 4(1.905,-2.683) 5(1.905,2.683) 6(0.635,2.683) 7(-0.635,2.683) 8(-1.905,2.683)
SOT-23-3_L2.9-W1.6-P1.90-LS2.8-BR
  rect 1.07x0.6 smd: 1(1.235,-0.95) 2(1.235,0.95) 3(-1.235,0)
SOT-23-5_L3.0-W1.7-P0.95-LS2.8-BL
  rect 0.49x1.157 smd: 1(-0.95,-1.153) 2(0,-1.153) 3(0.95,-1.153)
  rect 0.49x1.175 smd: 4(0.95,1.153) 5(-0.95,1.153)
SW-SMD_TS24CA
  rect 0.9x1.2 smd: 1(-2.3,0.775) 2(2.3,0.775)
  rect 1.2x1.3 smd: 3(-1.675,-0.775) 4(1.675,-0.775)
SW-TH_3P-L9.1-W3.5-P2.50-A3
  round 1.524 hole 0.914: 1(-2.54,0) 2(0,0) 3(2.54,0)
USB-C-SMD_TYPE-C-6PIN-2MD-073
  rect 0.55x1.1 smd: 1(-3.2,2.375) 2(-2.4,2.375) 11(2.4,2.375) 12(3.2,2.375)
  rect 0.3x1.1 smd: 3(-1.75,2.375) 4(-1.25,2.375) 5(-0.75,2.375) 6(-0.25,2.375) 7(0.25,2.375) 8(0.75,2.375) 9(1.25,2.375) 10(1.75,2.375)
  oval 1.1x2 hole 0.6x1.5: 13(-4.325,1.825) 14(4.325,1.825)
  oval 1.2x1.8 hole 0.6x1.2: 13(-4.325,-2.375) 14(4.325,-2.375)
WSON-10_L2.5-W2.5-P0.50-BL-EP
  rect 0.28x0.665 smd: 1(-1,-1.157) 2(-0.5,-1.157) 3(0,-1.157) 4(0.5,-1.157) 5(1,-1.157) 6(1,1.157) 7(0.5,1.157) 8(0,1.157) 9(-0.5,1.157) 10(-1,1.157)
  rect 2x1.25 smd: 11(0,0)

## Nets
As in the schematic.

Pads without a net: RT9013 4; SW1 3; U1 2 3 4 14 15 16 17 18 19 20 21 22 25 26 27 28 29 32 33 38 39 40 45 46; U2 4; U4 2 3 4 5 6 7 14 15 16 17 19 21 22 25; USB1 3 9

## Via types
v1: diameter 1.524, hole 1.524, Top Layer to Bottom Layer, 1 via
v2: diameter 2.4, hole 2.4, Top Layer to Bottom Layer, 1 via
v3: diameter 0.61, hole 0.305, Top Layer to Bottom Layer, 69 vias

## Routing (per net, layer and track width the routed paths; a pad name or vN(x,y) marks a point on that pad's centre or on a via; arc(x,y) is an arc through that point)
3V3: length 158.7
  Top Layer w0.305: U1.24 46.18,8.58 47.35,8.58 47.6,8.84 47.6,12.75 48.06,13.21 48.73,13.21 C9.1 ; U4.13 28.25,12.61 C16.1 ; C22.1 26.28,17.98 26.95,17.32 U4.8
  Top Layer w0.381: U1.36 42.31,15.64 C10.1 ; C11.1 35.33,10.78 U1.48 ; v3(40.13,1.83) 38.95,1.83 L2.2 ; 37.53,18.31 R7.1 ; 37.53,18.31 R8.1 ; 37.53,18.31 37.53,19.4 37.49,19.45
  Top Layer w0.508: 21.01,3.78 RT9013.5 21.8,1.08 LED3.2 ; 21.01,3.78 U2.5 20.9,6.67 C8.1 ; 21.01,3.78 26.24,3.78 ; 42.39,19.45 42.31,19.36 C10.1 ; 42.39,19.45 38.76,19.45 ; 42.39,19.45 52.19,19.45 ; 26.24,3.78 26.26,3.76 C6.1 ; 26.24,3.78 26.24,4.45 26.72,4.93 v3(28.7,4.93) 28.7,8.89 28.65,8.94 ; C9.1 51.91,13.25 H1.4 53.44,13.41 53.7,13.67 53.7,19.05 53.3,19.45 52.19,19.45 ; 25.17,19.45 25.24,19.38 C22.1 ; 25.17,19.45 17.26,19.45 16.76,18.95 16.76,14.12 17.37,13.51 25.4,13.51 26.57,12.34 ; 25.17,19.45 38.76,19.45 ; 26.57,12.34 26.57,11.02 28.65,8.94 ; 26.57,12.34 C16.1 ; 38.76,19.45 38.76,19.44 v3(38.76,18.34) ; 52.19,19.45 52.22,19.41 STLink1.1 ; 28.65,8.94 29.87,8.94 31.71,10.78 C11.1 ; 52.78,17.88 52.83,17.83
  Bottom Layer w0.305: BOOT0.2 38.76,16.83 v3(38.76,18.34)
  Bottom Layer w0.381: v3(40.13,1.83) 40.13,0.49 31.46,0.49 31.24,0.71 31.24,4.81 31.13,4.93
  Bottom Layer w0.508: R11.2 33.54,4.93 v3(28.7,4.93)
GND: length 45.8
  Top Layer w0.254: C19.2 42.1,1.07 v3(40.84,1.07) ; C15.1 23.89,14.72 24.15,14.46 25.86,14.46 26.11,14.71 26.11,15.44 26.48,15.82 U4.11 ; U4.9 25,16.82 C22.2 ; RT9013.2 17.04,1.88 16.44,2.48 C5.2 ; U4.18 31.85,14.57
  Top Layer w0.305: Control.3 48.12,1.98 Control.1
  Top Layer w0.381: Control.2 42.14,1.05 C19.2
  Top Layer w0.508: USB1.12 5.78,12.46 USB1.14 USB1.14 ; USB1.1 13.33,12.46 USB1.13 USB1.13
  Bottom Layer w0.254: 12.46,16.18 14.5,16.18 PROG0.1
  Bottom Layer w0.305: RT6150.9 12.64,5.14 RT6150.11 RT6150.3
  Bottom Layer w0.381: USB1.13 15.36,17.21 PROG0.1
  Bottom Layer w0.635: 12.46,16.18 11.54,16.18 10.91,16.81 TP4056.9
  Bottom Layer w0.762: C4.2 15.37,4.64 RT6150.11 9.65,4.64 C3.2
  vias: v3(1.47,2.44) v3(2.08,13.51) v3(3.05,7.62) v3(3.05,6.35) v3(4.27,1.37) v3(5.79,6.71) v3(8.23,4.83) v3(16.36,11.33) v3(18.24,5.08) v3(18.29,12.55) v3(18.29,11.33) v3(19.91,12.55) v3(21.34,8.28) v3(22.76,8.28) v3(24.59,16.46) v3(24.79,8.03) v3(26.16,13.87) v3(27.63,4.11) v3(29.77,8.08) v3(29.77,6.45) v3(30.12,10.77) v3(31.75,8.08) v3(31.75,6.45) v3(32.36,18.59) v3(34.65,14.99) v3(35.56,12.99) v3(35.71,4.57) v3(38.61,16.05) v3(39.32,1.17) v3(39.73,7.62) v3(39.94,12.56) v3(40.84,17.07) v3(41.1,4.88) v3(41.62,12.56) v3(41.71,7.67) v3(44.04,5.39) v3(46.43,6.2) v3(47.19,14.53) v3(47.24,5.39) v3(49.63,9.6) v3(50.09,14.53) v3(50.14,11.12) v3(50.75,15.7) v3(51.24,2.95) v3(52.43,15.7) v3(53.59,3)
VBAT_E: length 3.1
  Top Layer w0.305: C18.1 34.17,7.51 U1.1
VCC_USB: length 46
  Top Layer w0.381: USB1.11 v3(7.15,11.52) 6.71,11.07 3.66,11.07 3.2,11.53 3.2,18.39 3.53,18.72 v3(4.11,18.72) ; v3(12.04,11.12) 11.95,11.21 USB1.2
  Bottom Layer w0.381: TP4056.8 v3(4.11,18.72) ; v3(7.15,11.52) 8.09,11.52 Q1.1 10.19,9.42 D2.1 12.41,9.42 R4.1 13.06,10.15 13.06,10.97 12.9,11.12 v3(12.04,11.12) 11.33,11.84 11.33,13.78 12.46,14.91
  Bottom Layer w0.508: LED2.2 22.82,15 22.34,14.52 19.5,14.52 ; 19.5,14.52 C1.1 15.05,14.91 12.46,14.91 ; 19.5,14.52 19.71,14.73 19.71,16.93 LED1.2
(no net):
  vias: v1(49.28,15.39) v2(1.63,11.68)
BOOT0: length 6.1
  Top Layer w0.254: v3(38.3,10.77) 38.3,11.51 37.18,12.64
  Bottom Layer w0.254: v3(38.3,10.77) 38.58,11.05 BOOT0.1 38.17,12.15 R12.1
D+: length 21.7
  Top Layer w0.254: 9.8,11.53 9.8,10.36 10.54,9.63 24.56,9.63 24.82,9.88 U2.1 ; 9.8,11.53 9.6,11.33 8.94,11.33 8.8,11.47 USB1.8 ; 9.8,11.53 9.8,12.45 USB1.6
D-: length 20
  Top Layer w0.254: USB1.7 9.3,13.36 9.45,13.51 10.16,13.51 10.31,13.36 10.31,12.47 USB1.5 10.31,12.45 10.31,10.62 10.82,10.11 23.37,10.11 23.55,10.29 U2.2
NRST: length 7.9
  Top Layer w0.254: U1.7 38.61,7.7 v3(38.61,9.3)
  Bottom Layer w0.254: v3(38.61,9.3) 38.61,7.86 RST0.1 37.61,6.87 R11.1 36.98,5.11 C17.1
OSC_IN: length 14
  Top Layer w0.254: X1.1 29.46,1.36 C13.2 28.13,3.04 29.31,4.22 33.71,4.22 37.18,7.69
OSC_OUT: length 8.3
  Top Layer w0.254: U1.6 34.69,4.48 C14.2 33.01,2.59 X1.3
PA0: length 9.6
  Top Layer w0.254: U1.10 37.79,4.76 37.79,3.71 38.1,3.4 39.68,3.4 40.6,2.48 C19.1 44.02,2.48 Control.4
PA1_LED: length 14.3
  Top Layer w0.254: v3(39.37,4.06) 38.96,4.06 38.6,4.42 38.6,4.87 U1.11
  Top Layer w0.305: v3(46.99,7.72) 48.71,7.72 48.72,7.71
  Bottom Layer w0.305: v3(39.37,4.06) 44.55,4.06 45.47,4.98 45.47,6.86 46.33,7.72 v3(46.99,7.72)
PA13_DIO: length 4.3
  Top Layer w0.254: STLink1.4 44.6,16.52 U1.34 42.5,14.4
PA14_CLK: length 9.6
  Top Layer w0.254: v3(40.54,16) 40.54,15.99 U1.37
  Bottom Layer w0.254: STLink1.3 47.14,16.15 46.99,16 v3(40.54,16)
PB5_INT: length 14.3
  Top Layer w0.178: v3(37.34,14.94) 37.34,14.6 U1.41 ; U4.12 27,15.32 26.77,15.09 v3(26.77,14.38)
  Bottom Layer w0.178: v3(26.77,14.38) 27.23,13.92 35.61,13.92 36.63,14.94 v3(37.34,14.94)
PB6_SCL: length 8.7
  Top Layer w0.178: U1.42 36.03,15.2 R8.2 35.52,16.81 33.53,16.81 33.03,17.32 U4.23
PB7_SDA: length 11.6
  Top Layer w0.178: R7.2 35.55,17.83 v3(33.68,17.83) 33.66,17.82 U4.24 ; U1.43 34.37,16.15 v3(33.68,16.15)
  Bottom Layer w0.178: v3(33.68,16.15) v3(33.68,17.83)
RXD: length 31.3
  Top Layer w0.254: v3(45.52,13.77) 44.68,13.77 U1.30 ; U2.7 23.55,9.02 v3(23.52,9.04)
  Bottom Layer w0.178: v3(45.52,13.77) 46.43,12.85 46.43,11.07 45.57,10.21 24.69,10.21 v3(23.52,9.04)
RXD2: length 14.2
  Top Layer w0.305: H1.2 50.44,8.33 50.14,8.03 50.14,4.72 49.84,4.42 42.57,4.42 U1.13
TXD: length 37.2
  Top Layer w0.254: v3(45.52,14.53) 44.73,14.53 U1.31 ; v3(23.98,5.08) 22.4,5.08 22.28,5.21 U2.6
  Bottom Layer w0.178: v3(45.52,14.53) 45.91,14.53 46.74,13.7 46.74,10.87 45.77,9.91 25.3,9.91 24.18,8.79 24.18,5.28 v3(23.98,5.08)
TXD2: length 23.3
  Top Layer w0.305: U1.12 41.21,3.66 53.39,3.66 53.75,4.01 53.75,10.72 53.59,10.87 H1.3
$1N2583: length 6.8
  Top Layer w0.305: C12.2 36.53,4.2 38.59,6.27
  Top Layer w0.381: L2.1 36.78,2.61 C12.2
$1N4826: length 5.8
  Top Layer w0.305: R9.1 v3(48.72,5.23) ; v3(48.72,3) 49.58,3 49.76,2.81 Signal.1
  Bottom Layer w0.305: v3(48.72,5.23) v3(48.72,3)
$1N5009: length 1.8
  Top Layer w0.508: 22.55,2.68 24.31,2.68 R10.2
$1N5948: length 2
  Top Layer w0.381: C7.1 26.72,6.56 U2.8
$1N6568: length 3.2
  Top Layer w0.254: 25.29,15.19 25.29,15.99 25.61,16.32 U4.10
$1N6572: length 2.3
  Top Layer w0.254: U4.20 32.28,15.82 C21.1
$1N8092: length 2.2
  Bottom Layer w0.381: RT6150.2 12.64,1.9 L1.2
$1N8095: length 3.4
  Bottom Layer w0.381: RT6150.10 13.22,5.87 R6.2 13.32,6.91 R5.1
$1N8102: length 8.5
  Top Layer w0.254: R1.2 7.8,10.33 USB1.10 7.8,13.64 8.08,13.92 10.52,13.92 10.82,13.61 10.82,12.48 USB1.4
$1N8103: length 1.7
  Bottom Layer w0.381: LED2.1 21.25,17.05 R3.2
$1N8104: length 1.7
  Bottom Layer w0.381: LED1.1 18.15,18.64 R2.2
$1N8106: length 18.2
  Bottom Layer w0.254: TP4056.7 7.27,17.45 7.52,17.7 7.52,19.15 7.94,19.57 21.85,19.57 R3.1
$1N8107: length 18
  Bottom Layer w0.254: TP4056.6 6.67,16.15 7.37,16.15 7.52,16 7.52,14.68 7.92,14.28 10.87,14.28 11.12,14.53 11.12,15.29 11.43,15.6 18.64,15.6 18.9,15.85 18.9,17.89 R2.1
$1N8108: length 3.5
  Bottom Layer w0.178: PROG0.2 15.43,18.64 13.65,18.64 12.46,17.45
$1N8109: length 13.7
  Bottom Layer w0.635: TP4056.5 4.6,14.91 3.96,14.28 3.96,11.64 C2.1 4.79,7.85 BAT1.1 6.97,7.64 7.45,8.11 Q1.3
$1N8111: length 2.3
  Bottom Layer w0.381: L1.1 11.64,2.11 RT6150.4
$1N8114: length 22.3
  Bottom Layer w0.508: SW1.2 5.33,0.91 4.98,0.56 1.27,0.56 0.66,1.17 0.66,4.22 1.34,4.9 5.31,4.9 8.2,7.79 Q1.2 11.04,7.79 D2.2
$1N8115: length 16.6
  Bottom Layer w0.254: RT6150.8 RT6150.7 RT6150.6 10.86,6.08 9.6,6.08
  Bottom Layer w0.381: RT6150.5 8.76,3.48 8.08,4.17 5.79,4.17
  Bottom Layer w0.508: 9.6,6.08 7.71,6.08 5.79,4.17 4.37,4.17 SW1.1
$1N8116: length 16.4
  Top Layer w0.381: v3(17.17,3.82) 17.74,3.25 RT9013.1 18.35,2.83 18.75,2.44 18.75,1.37 18.3,0.93 RT9013.3 15.49,0.93 C5.1
  Bottom Layer w0.381: RT6150.1 15.61,3.48 C4.1 17.02,3.67 v3(17.17,3.82) 17.17,6.35 16.6,6.92 R5.2

## Copper pours and planes (outline as drawn; the poured copper is in the pictures)
GND on Top Layer: -5.13,24.79 58.32,24.79 58.32,-4.62 -5.13,-4.62
GND on Bottom Layer: -2.95,22.81 56.64,22.81 56.64,-1.88 -2.95,-1.88

Small or netless copper shapes (teardrops, artwork), in the pictures only: 136 on Top Layer, 92 on Bottom Layer

## Text on the board
Bottom Silkscreen Layer: 7YEWH
Top Silkscreen Layer: CSDN | 7YEWH
